# Altium schematic sheet Power.SchDoc
size A
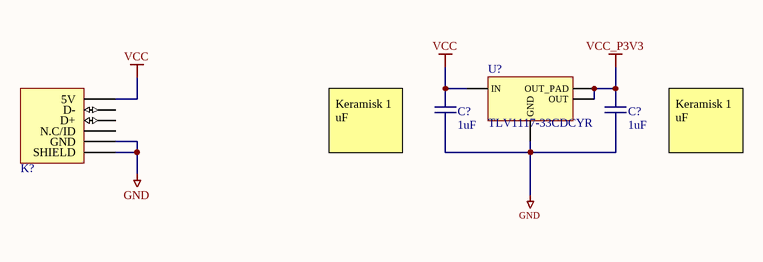
[diagram p0: Power.SchDoc]

## Parts
(Parts that share a designator on the sheet are numbered #1, #2 ... from top to bottom, then left to right.)
C?#1  1uF  [CAPC0805(2012)100_N]
C?#2  1uF  [CAPC0805(2012)100_N]
K?  USB_CONNECTOR_5P  [105017-0001]  (value not drawn)
U?  TLV1117-33CDCYR  [SOT230P700X180-4N]

## Nets
GND: C?#1.1 C?#2.1 K?.0(SHIELD) K?.5(GND) U?.1(GND)
VCC: C?#1.2 K?.1(5V) U?.3(IN)
VCC_P3V3: C?#2.2 U?.2(OUT_PAD) U?.4(OUT)

Not connected (* = marked no-connect by the designer): K? 2(D-) 3(D+) 4(N.C/ID)

## Notes on the sheet
- (near C?#1) Keramisk 1 uF
- (near C?#2) Keramisk 1 uF

## Library data of the parts
C?#1 C?#2 = 3582: X7R 50V 10%; id: 3582; pakke_opprettet_av: 815; leverandor_varenr: 1735541; pris: 4; nokkelord: Kondensator, capacitor; produsent: Murata; leverandor: Farnell; pakketype: 0805; pakke_opprettet: 14-Nov-14 8:52:01 PM; symbol_opprettet_av: 815; symbol_opprettet: 14-Nov-14 8:19:34 PM; navn: 1uF
K? = 4034: Micro USB Type B; id: 4034; pakke_opprettet_av: 1335; symbol_opprettet_av: 924; leverandor_varenr: 2293836; navn: USB Micro; pris: 0; nokkelord: USB Connector, Micro USB Type B, USB 2.0, Receptacle, 5 Ways, Surface Mount, Right Angle; leverandor: Farnell; pakketype: SMD; pakke_opprettet: 21-Feb-17 11:55:20 PM; symbol_opprettet: 30-Jul-15 6:06:06 PM
U? = 2386: 3,3V Low dropout regulator; id: 2386; rad: 2; rom: OV; lager_type: Fremlager; dybde: 0; hylle: 9; antall: 63; pakke_opprettet_av: 774; leverandor_varenr: 2447986; pris: 5; nokkelord: ldo; produsent: Texas Instruments; leverandor: Farnell; pakketype: SOT; kolonne: 0; pakke_opprettet: 7/11/2014 10:00:23 PM; symbol_opprettet_av: 774; symbol_opprettet: 7/11/2014 10:01:42 PM; navn: TLV1117-33CDCYR